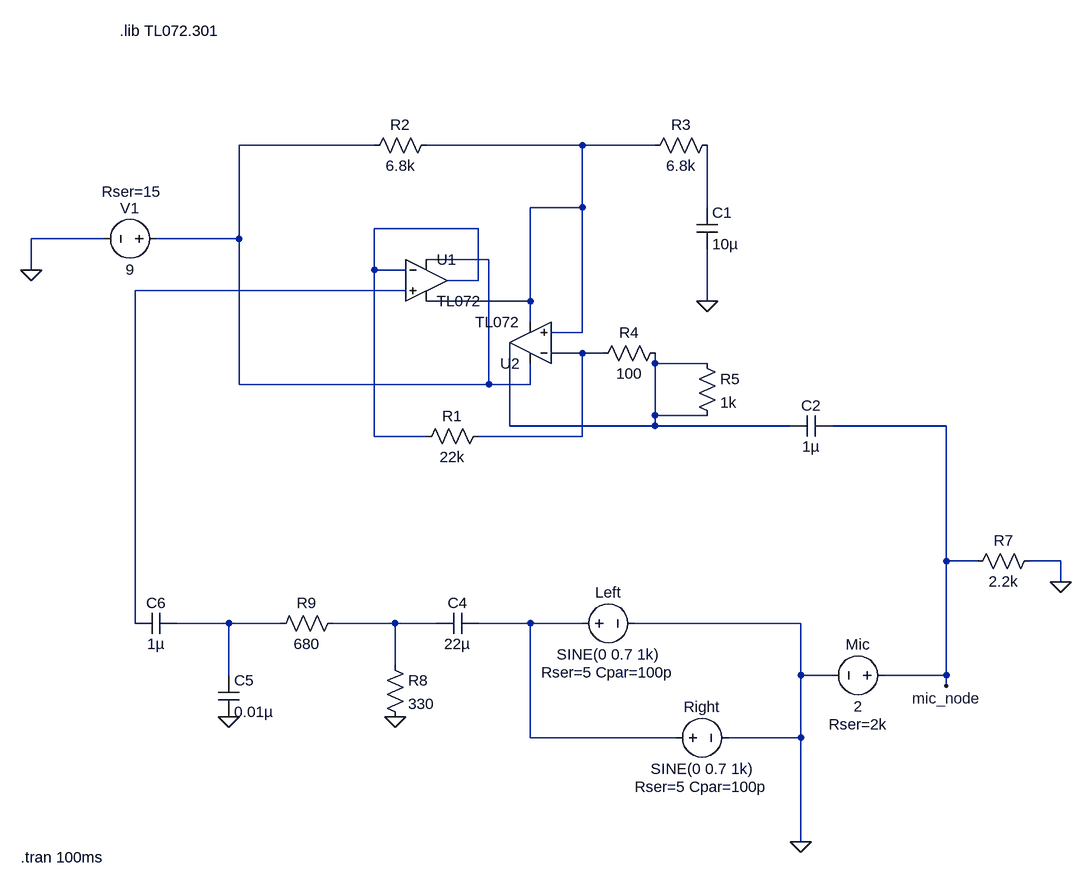
[diagram p0: schematic audioLoopback.asc]
audioLoopback.asc, the LTspice schematic file:
Version 4.1
SHEET 1 880 808
WIRE -320 -304 -528 -304
WIRE 0 -304 -240 -304
WIRE 112 -304 0 -304
WIRE 0 -208 0 -304
WIRE 0 -208 -80 -208
WIRE 192 -208 192 -304
WIRE -160 -176 -320 -176
WIRE -736 -160 -848 -160
WIRE -528 -160 -528 -304
WIRE -528 -160 -656 -160
WIRE -144 -128 -240 -128
WIRE -848 -112 -848 -160
WIRE -320 -112 -320 -176
WIRE -272 -112 -320 -112
WIRE -160 -96 -160 -176
WIRE -160 -96 -208 -96
WIRE -272 -80 -688 -80
WIRE -80 -64 -80 -208
WIRE -80 -64 -240 -64
WIRE 192 -64 192 -144
WIRE -80 -32 -80 -64
WIRE 0 -16 0 -208
WIRE 0 -16 -48 -16
WIRE 0 16 -48 16
WIRE 32 16 0 16
WIRE 112 32 112 16
WIRE 192 32 112 32
WIRE -528 64 -528 -160
WIRE -144 64 -144 -128
WIRE -144 64 -528 64
WIRE -80 64 -80 32
WIRE -80 64 -144 64
WIRE 112 112 112 32
WIRE 192 112 112 112
WIRE -112 128 -112 0
WIRE 112 128 112 112
WIRE 112 128 -112 128
WIRE 320 128 112 128
WIRE 560 128 384 128
WIRE -320 144 -320 -112
WIRE -240 144 -320 144
WIRE 0 144 0 16
WIRE 0 144 -160 144
WIRE 560 336 560 128
WIRE 608 336 560 336
WIRE 736 336 688 336
WIRE 736 368 736 336
WIRE -688 432 -688 -80
WIRE -544 432 -624 432
WIRE -464 432 -544 432
WIRE -288 432 -384 432
WIRE -224 432 -288 432
WIRE -80 432 -160 432
WIRE 0 432 -80 432
WIRE 336 432 80 432
WIRE -288 496 -288 432
WIRE -544 512 -544 432
WIRE 336 512 336 432
WIRE 384 512 336 512
WIRE 560 512 560 336
WIRE 560 512 464 512
WIRE 560 528 560 512
WIRE -80 608 -80 432
WIRE 144 608 -80 608
WIRE 336 608 336 512
WIRE 336 608 224 608
WIRE 336 768 336 608
FLAG -848 -112 0
FLAG 192 -64 0
FLAG 736 368 0
FLAG 336 768 0
FLAG -288 576 0
FLAG -544 576 0
FLAG 560 528 mic_node
SYMBOL OpAmps\\opamp2 -240 -160 R0
SYMATTR InstName U1
SYMATTR Value TL072
SYMBOL OpAmps\\opamp2 -80 64 R180
SYMATTR InstName U2
SYMATTR Value TL072
SYMBOL voltage -640 -160 R90
WINDOW 0 -32 56 VBottom 2
WINDOW 3 32 56 VTop 2
WINDOW 123 0 0 Left 0
WINDOW 39 -57 53 VBottom 2
SYMATTR InstName V1
SYMATTR Value 9
SYMATTR SpiceLine Rser=15
SYMBOL res -144 128 R90
WINDOW 0 0 56 VBottom 2
WINDOW 3 32 56 VTop 2
SYMATTR InstName R1
SYMATTR Value 22k
SYMBOL res -224 -320 R90
WINDOW 0 0 56 VBottom 2
WINDOW 3 32 56 VTop 2
SYMATTR InstName R2
SYMATTR Value 6.8k
SYMBOL res 208 -320 R90
WINDOW 0 0 56 VBottom 2
WINDOW 3 32 56 VTop 2
SYMATTR InstName R3
SYMATTR Value 6.8k
SYMBOL cap 176 -208 R0
SYMATTR InstName C1
SYMATTR Value 10µ
SYMBOL res 128 0 R90
WINDOW 0 0 56 VBottom 2
WINDOW 3 32 56 VTop 2
SYMATTR InstName R4
SYMATTR Value 100
SYMBOL res 176 16 R0
SYMATTR InstName R5
SYMATTR Value 1k
SYMBOL cap 384 112 R90
WINDOW 0 0 32 VBottom 2
WINDOW 3 32 32 VTop 2
SYMATTR InstName C2
SYMATTR Value 1µ
SYMBOL res 704 320 R90
WINDOW 0 0 56 VBottom 2
WINDOW 3 32 56 VTop 2
SYMATTR InstName R7
SYMATTR Value 2.2k
SYMBOL voltage 480 512 R90
WINDOW 0 -32 56 VBottom 2
WINDOW 3 32 56 VTop 2
WINDOW 123 0 0 Left 0
WINDOW 39 60 56 VTop 2
SYMATTR InstName Mic
SYMATTR Value 2
SYMATTR SpiceLine Rser=2k
SYMBOL voltage -16 432 R270
WINDOW 0 32 56 VTop 2
WINDOW 3 -32 56 VBottom 2
WINDOW 123 0 0 Left 0
WINDOW 39 -60 56 VBottom 2
SYMATTR InstName Left
SYMATTR Value SINE(0 0.7 1k)
SYMATTR SpiceLine Rser=5 Cpar=100p
SYMBOL voltage 128 608 R270
WINDOW 0 32 56 VTop 2
WINDOW 3 -32 56 VBottom 2
WINDOW 123 0 0 Left 0
WINDOW 39 -60 56 VBottom 2
SYMATTR InstName Right
SYMATTR Value SINE(0 0.7 1k)
SYMATTR SpiceLine Rser=5 Cpar=100p
SYMBOL cap -160 416 R90
WINDOW 0 0 32 VBottom 2
WINDOW 3 32 32 VTop 2
SYMATTR InstName C4
SYMATTR Value 22µ
SYMBOL res -304 480 R0
SYMATTR InstName R8
SYMATTR Value 330
SYMBOL res -368 416 R90
WINDOW 0 0 56 VBottom 2
WINDOW 3 32 56 VTop 2
SYMATTR InstName R9
SYMATTR Value 680
SYMBOL cap -560 512 R0
SYMATTR InstName C5
SYMATTR Value 0.01µ
SYMBOL cap -624 416 R90
WINDOW 0 0 32 VBottom 2
WINDOW 3 32 32 VTop 2
SYMATTR InstName C6
SYMATTR Value 1µ
TEXT -712 -480 Left 2 !.lib TL072.301
TEXT -864 792 Left 2 !.tran 100ms

The netlist it stands for:
* audioLoopback.asc
X§U1 N005 N004 N001 N002 N004 TL072  ; pins In+ In- V+ V- OUT
X§U2 N002 N006 N001 N002 N007 TL072  ; pins In+ In- V+ V- OUT
V1 N001 0 9 Rser=15
R1 N006 N004 22k
R2 N002 N001 6.8k
R3 N003 N002 6.8k
C1 N003 0 10µ
R4 N007 N006 100
R5 N007 N007 1k
C2 mic_node N007 1µ
R7 0 mic_node 2.2k
V§Mic mic_node 0 2 Rser=2k
V§Left N010 0 SINE(0 0.7 1k) Rser=5 Cpar=100p
V§Right N010 0 SINE(0 0.7 1k) Rser=5 Cpar=100p
C4 N010 N009 22µ
R8 N009 0 330
R9 N009 N008 680
C5 N008 0 0.01µ
C6 N008 N005 1µ
.lib TL072.301
.tran 100ms
.backanno
.end